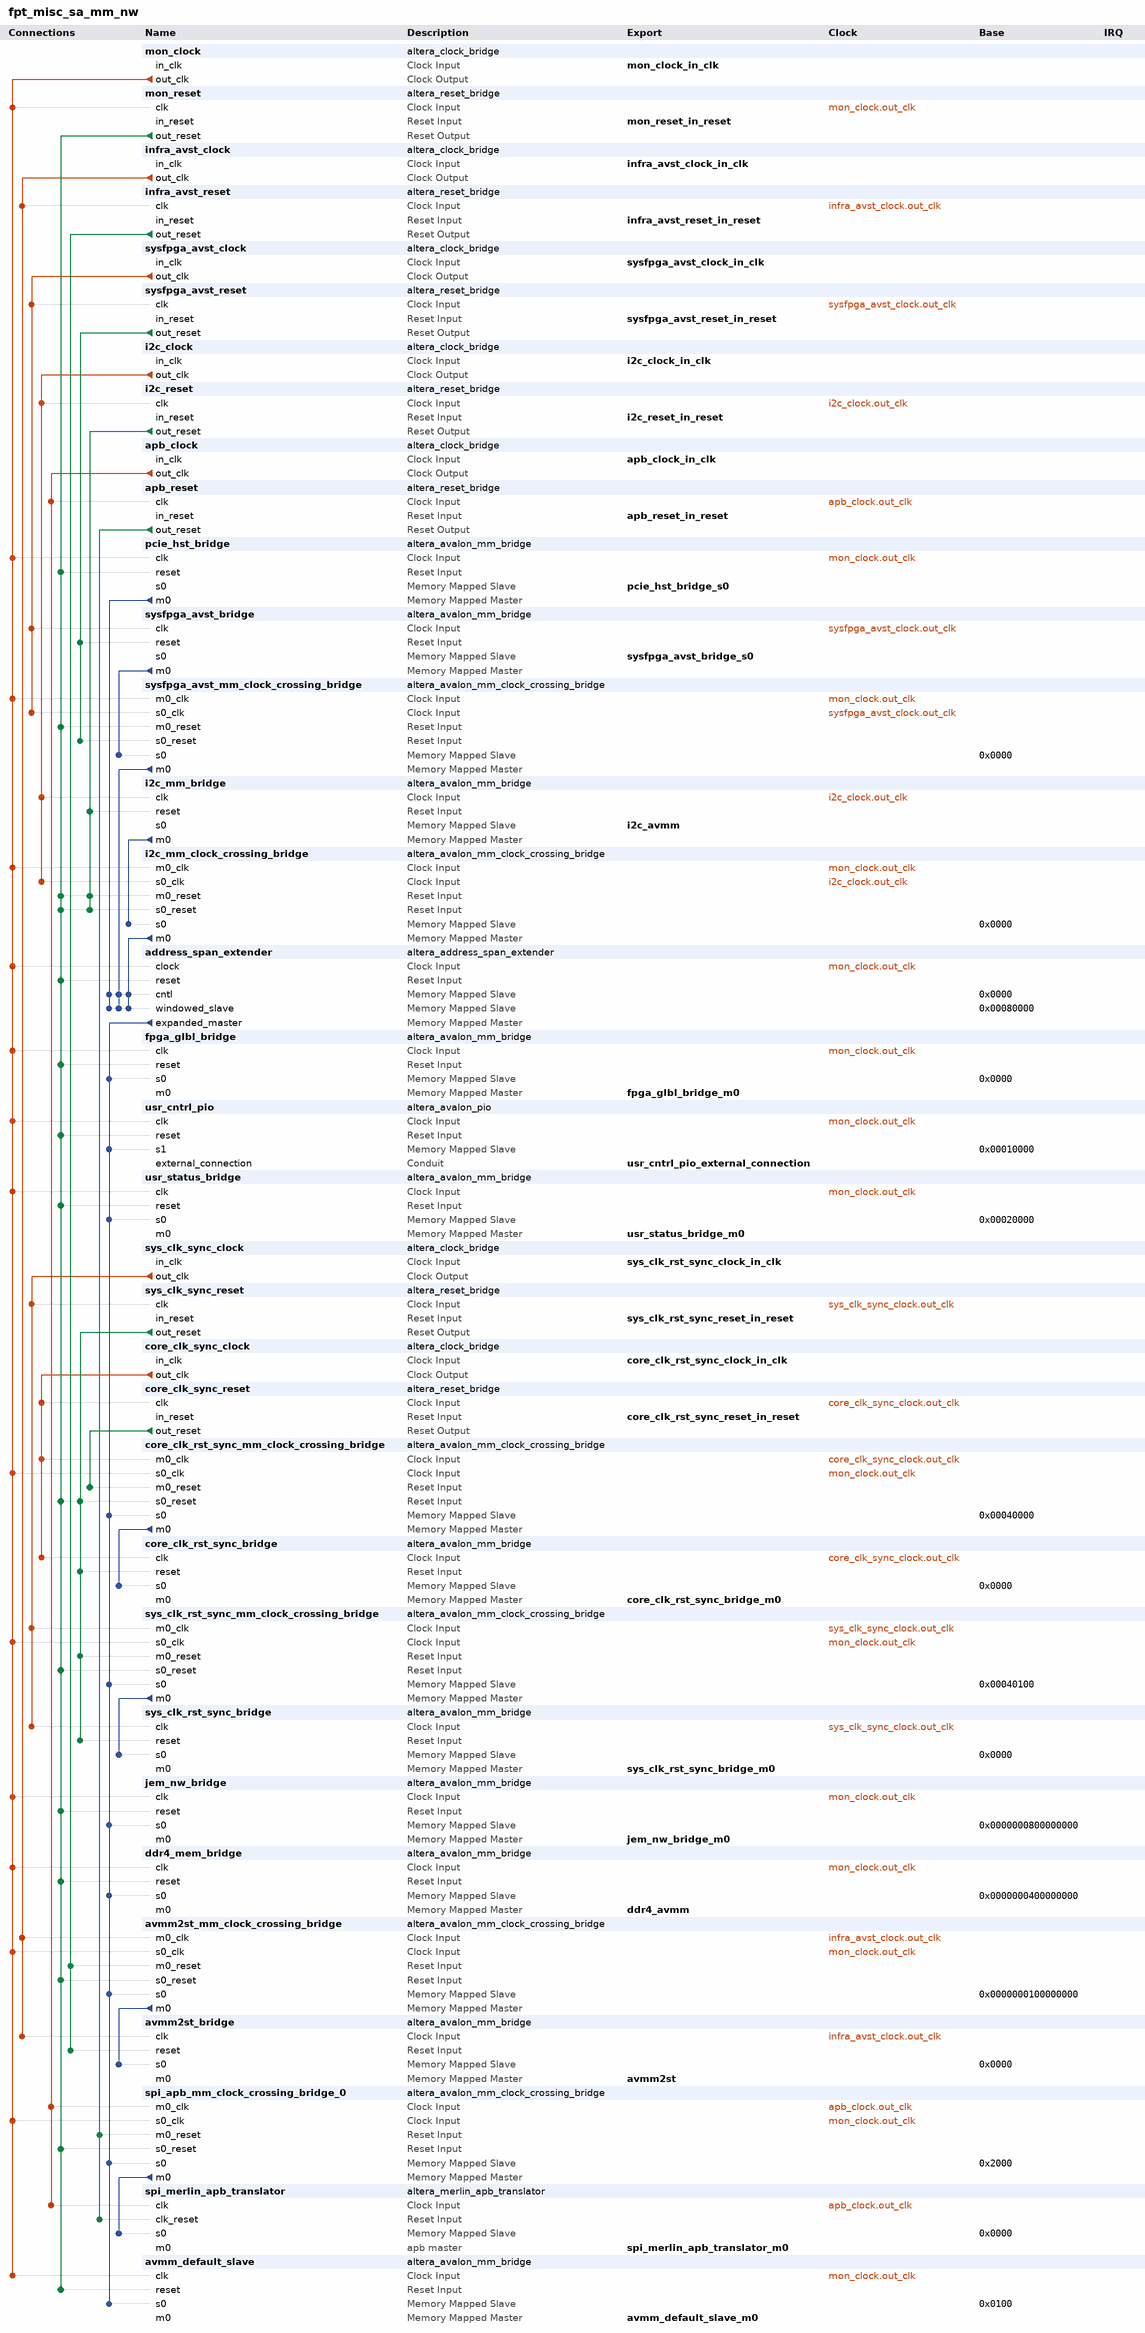
[diagram p0: system contents]
# Platform Designer (Qsys) system fpt_misc_sa_mm_nw, Stratix 10 1SG280LU3F50E1VG
# Parameters at their usual value, and those the tool derives, are not listed.
package require -exact qsys 1.0
create_system fpt_misc_sa_mm_nw
set_project_property DEVICE_FAMILY {Stratix 10}
set_project_property DEVICE 1SG280LU3F50E1VG

add_component mon_clock ip/fpt_misc_sa_mm_nw/fpt_misc_sa_mm_nw_clock_in.ip altera_clock_bridge mon_clock 19.2.0
load_component mon_clock
set_component_parameter_value DERIVED_CLOCK_RATE 0
set_component_parameter_value EXPLICIT_CLOCK_RATE 0
save_component

add_component mon_reset ip/fpt_misc_sa_mm_nw/fpt_misc_sa_mm_nw_reset_in.ip altera_reset_bridge mon_reset 19.2.0
load_component mon_reset
set_component_parameter_value ACTIVE_LOW_RESET 1
set_component_parameter_value SYNCHRONOUS_EDGES deassert
set_component_parameter_value SYNC_RESET 0
save_component

add_component infra_avst_clock ip/fpt_misc_sa_mm_nw/mon_clock_0.ip altera_clock_bridge infra_avst_clock 19.2.0
load_component infra_avst_clock
set_component_parameter_value DERIVED_CLOCK_RATE 0
set_component_parameter_value EXPLICIT_CLOCK_RATE 0
save_component

add_component infra_avst_reset ip/fpt_misc_sa_mm_nw/mon_reset_0.ip altera_reset_bridge infra_avst_reset 19.2.0
load_component infra_avst_reset
set_component_parameter_value ACTIVE_LOW_RESET 1
set_component_parameter_value SYNCHRONOUS_EDGES deassert
set_component_parameter_value SYNC_RESET 0
save_component

add_component sysfpga_avst_clock ip/fpt_misc_sa_mm_nw/infra_avst_clock_0.ip altera_clock_bridge sysfpga_avst_clock 19.2.0
load_component sysfpga_avst_clock
set_component_parameter_value DERIVED_CLOCK_RATE 0
set_component_parameter_value EXPLICIT_CLOCK_RATE 0
save_component

add_component sysfpga_avst_reset ip/fpt_misc_sa_mm_nw/infra_avst_reset_0.ip altera_reset_bridge sysfpga_avst_reset 19.2.0
load_component sysfpga_avst_reset
set_component_parameter_value ACTIVE_LOW_RESET 1
set_component_parameter_value SYNCHRONOUS_EDGES deassert
set_component_parameter_value SYNC_RESET 0
save_component

add_component i2c_clock ip/fpt_misc_sa_mm_nw/fpt_misc_sa_mm_nw_clock_bridge_1.ip altera_clock_bridge i2c_clock 19.2.0
load_component i2c_clock
set_component_parameter_value DERIVED_CLOCK_RATE 0
set_component_parameter_value EXPLICIT_CLOCK_RATE 0
save_component

add_component i2c_reset ip/fpt_misc_sa_mm_nw/fpt_misc_sa_mm_nw_reset_bridge_1.ip altera_reset_bridge i2c_reset 19.2.0
load_component i2c_reset
set_component_parameter_value ACTIVE_LOW_RESET 1
set_component_parameter_value SYNCHRONOUS_EDGES deassert
set_component_parameter_value SYNC_RESET 0
save_component

add_component apb_clock ip/fpt_misc_sa_mm_nw/i2c_clock_0.ip altera_clock_bridge apb_clock 19.2.0
load_component apb_clock
set_component_parameter_value DERIVED_CLOCK_RATE 0
set_component_parameter_value EXPLICIT_CLOCK_RATE 0
save_component

add_component apb_reset ip/fpt_misc_sa_mm_nw/i2c_reset_0.ip altera_reset_bridge apb_reset 19.2.0
load_component apb_reset
set_component_parameter_value ACTIVE_LOW_RESET 1
set_component_parameter_value SYNCHRONOUS_EDGES deassert
set_component_parameter_value SYNC_RESET 0
save_component

add_component pcie_hst_bridge ip/fpt_misc_sa_mm_nw/fpt_misc_sa_mm_nw_mm_bridge_0.ip altera_avalon_mm_bridge pcie_hst_bridge 20.0.0
load_component pcie_hst_bridge
set_component_parameter_value DATA_WIDTH 32
set_component_parameter_value ADDRESS_WIDTH 20
set_component_parameter_value USE_AUTO_ADDRESS_WIDTH 0
set_component_parameter_value ADDRESS_UNITS SYMBOLS
set_component_parameter_value MAX_PENDING_RESPONSES 4
set_component_parameter_value MAX_PENDING_WRITES 0
set_component_parameter_value SYNC_RESET 0
set_component_parameter_value USE_WRITERESPONSE 0
save_component

add_component sysfpga_avst_bridge ip/fpt_misc_sa_mm_nw/pcie_hst_bridge_0.ip altera_avalon_mm_bridge sysfpga_avst_bridge 20.0.0
load_component sysfpga_avst_bridge
set_component_parameter_value DATA_WIDTH 32
set_component_parameter_value ADDRESS_WIDTH 24
set_component_parameter_value USE_AUTO_ADDRESS_WIDTH 0
set_component_parameter_value ADDRESS_UNITS SYMBOLS
set_component_parameter_value MAX_PENDING_RESPONSES 4
set_component_parameter_value MAX_PENDING_WRITES 0
set_component_parameter_value SYNC_RESET 0
set_component_parameter_value USE_WRITERESPONSE 0
save_component

add_component sysfpga_avst_mm_clock_crossing_bridge ip/fpt_misc_sa_mm_nw/fpt_misc_sa_mm_nw_mm_clock_crossing_bridge_1.ip altera_avalon_mm_clock_crossing_bridge sysfpga_avst_mm_clock_crossing_bridge 19.2.0
load_component sysfpga_avst_mm_clock_crossing_bridge
set_component_parameter_value DATA_WIDTH 32
set_component_parameter_value ADDRESS_WIDTH 24
set_component_parameter_value USE_AUTO_ADDRESS_WIDTH 0
set_component_parameter_value MAX_BURST_SIZE 1
set_component_parameter_value COMMAND_FIFO_DEPTH 4
set_component_parameter_value RESPONSE_FIFO_DEPTH 4
set_component_parameter_value MASTER_SYNC_DEPTH 2
set_component_parameter_value SLAVE_SYNC_DEPTH 2
set_component_parameter_value SYNC_RESET 0
save_component

add_component i2c_mm_bridge ip/fpt_misc_sa_mm_nw/fpt_misc_sa_mm_nw_mm_bridge_3.ip altera_avalon_mm_bridge i2c_mm_bridge 20.0.0
load_component i2c_mm_bridge
set_component_parameter_value DATA_WIDTH 32
set_component_parameter_value ADDRESS_WIDTH 20
set_component_parameter_value USE_AUTO_ADDRESS_WIDTH 0
set_component_parameter_value ADDRESS_UNITS SYMBOLS
set_component_parameter_value MAX_PENDING_RESPONSES 4
set_component_parameter_value MAX_PENDING_WRITES 0
set_component_parameter_value SYNC_RESET 0
set_component_parameter_value USE_WRITERESPONSE 0
save_component

add_component i2c_mm_clock_crossing_bridge ip/fpt_misc_sa_mm_nw/fpt_misc_sa_mm_nw_mm_clock_crossing_bridge_3.ip altera_avalon_mm_clock_crossing_bridge i2c_mm_clock_crossing_bridge 19.2.0
load_component i2c_mm_clock_crossing_bridge
set_component_parameter_value DATA_WIDTH 32
set_component_parameter_value ADDRESS_WIDTH 20
set_component_parameter_value USE_AUTO_ADDRESS_WIDTH 0
set_component_parameter_value MAX_BURST_SIZE 1
set_component_parameter_value COMMAND_FIFO_DEPTH 4
set_component_parameter_value RESPONSE_FIFO_DEPTH 4
set_component_parameter_value MASTER_SYNC_DEPTH 2
set_component_parameter_value SLAVE_SYNC_DEPTH 2
set_component_parameter_value SYNC_RESET 0
save_component

add_component address_span_extender ip/fpt_misc_sa_mm_nw/fpt_misc_sa_mm_nw_address_span_extender_0.ip altera_address_span_extender address_span_extender 19.2.0
load_component address_span_extender
set_component_parameter_value DATA_WIDTH 32
set_component_parameter_value MASTER_ADDRESS_WIDTH 36
set_component_parameter_value SLAVE_ADDRESS_WIDTH 16
set_component_parameter_value BURSTCOUNT_WIDTH 11
set_component_parameter_value SUB_WINDOW_COUNT 4
set_component_parameter_value MASTER_ADDRESS_DEF 0
set_component_parameter_value ENABLE_SLAVE_PORT true
set_component_parameter_value MAX_PENDING_READS 4
set_component_parameter_value SYNC_RESET 0
save_component

add_component fpga_glbl_bridge ip/fpt_misc_sa_mm_nw/fpt_misc_sa_mm_nw_mm_bridge_1.ip altera_avalon_mm_bridge fpga_glbl_bridge 20.0.0
load_component fpga_glbl_bridge
set_component_parameter_value DATA_WIDTH 32
set_component_parameter_value ADDRESS_WIDTH 8
set_component_parameter_value USE_AUTO_ADDRESS_WIDTH 0
set_component_parameter_value ADDRESS_UNITS SYMBOLS
set_component_parameter_value MAX_PENDING_RESPONSES 4
set_component_parameter_value MAX_PENDING_WRITES 0
set_component_parameter_value SYNC_RESET 0
set_component_parameter_value USE_WRITERESPONSE 0
save_component

add_component usr_cntrl_pio ip/fpt_misc_sa_mm_nw/fpt_misc_sa_mm_nw_pio_0.ip altera_avalon_pio usr_cntrl_pio 19.1.0
load_component usr_cntrl_pio
set_component_parameter_value bitModifyingOutReg true
set_component_parameter_value direction Output
set_component_parameter_value width 32
save_component

add_component usr_status_bridge ip/fpt_misc_sa_mm_nw/fpga_glbl_bridge_0.ip altera_avalon_mm_bridge usr_status_bridge 20.0.0
load_component usr_status_bridge
set_component_parameter_value DATA_WIDTH 32
set_component_parameter_value ADDRESS_WIDTH 8
set_component_parameter_value USE_AUTO_ADDRESS_WIDTH 0
set_component_parameter_value ADDRESS_UNITS SYMBOLS
set_component_parameter_value MAX_PENDING_RESPONSES 4
set_component_parameter_value MAX_PENDING_WRITES 0
set_component_parameter_value SYNC_RESET 0
set_component_parameter_value USE_WRITERESPONSE 0
save_component

add_component sys_clk_sync_clock ip/fpt_misc_sa_mm_nw/fpt_misc_sa_mm_nw_clock_bridge_0.ip altera_clock_bridge sys_clk_sync_clock 19.2.0
load_component sys_clk_sync_clock
set_component_parameter_value DERIVED_CLOCK_RATE 0
set_component_parameter_value EXPLICIT_CLOCK_RATE 0
save_component

add_component sys_clk_sync_reset ip/fpt_misc_sa_mm_nw/fpt_misc_sa_mm_nw_reset_bridge_0.ip altera_reset_bridge sys_clk_sync_reset 19.2.0
load_component sys_clk_sync_reset
set_component_parameter_value ACTIVE_LOW_RESET 1
set_component_parameter_value SYNCHRONOUS_EDGES deassert
set_component_parameter_value SYNC_RESET 0
save_component

add_component core_clk_sync_clock ip/fpt_misc_sa_mm_nw/sys_clk_sync_clock_0.ip altera_clock_bridge core_clk_sync_clock 19.2.0
load_component core_clk_sync_clock
set_component_parameter_value DERIVED_CLOCK_RATE 0
set_component_parameter_value EXPLICIT_CLOCK_RATE 0
save_component

add_component core_clk_sync_reset ip/fpt_misc_sa_mm_nw/sys_clk_sync_reset_0.ip altera_reset_bridge core_clk_sync_reset 19.2.0
load_component core_clk_sync_reset
set_component_parameter_value ACTIVE_LOW_RESET 1
set_component_parameter_value SYNCHRONOUS_EDGES deassert
set_component_parameter_value SYNC_RESET 0
save_component

add_component core_clk_rst_sync_mm_clock_crossing_bridge ip/fpt_misc_sa_mm_nw/fpt_misc_sa_mm_nw_mm_clock_crossing_bridge_2.ip altera_avalon_mm_clock_crossing_bridge core_clk_rst_sync_mm_clock_crossing_bridge 19.2.0
load_component core_clk_rst_sync_mm_clock_crossing_bridge
set_component_parameter_value DATA_WIDTH 32
set_component_parameter_value ADDRESS_WIDTH 8
set_component_parameter_value USE_AUTO_ADDRESS_WIDTH 0
set_component_parameter_value MAX_BURST_SIZE 1
set_component_parameter_value COMMAND_FIFO_DEPTH 4
set_component_parameter_value RESPONSE_FIFO_DEPTH 4
set_component_parameter_value MASTER_SYNC_DEPTH 2
set_component_parameter_value SLAVE_SYNC_DEPTH 2
set_component_parameter_value SYNC_RESET 0
save_component

add_component core_clk_rst_sync_bridge ip/fpt_misc_sa_mm_nw/usr_status_bridge_0.ip altera_avalon_mm_bridge core_clk_rst_sync_bridge 20.0.0
load_component core_clk_rst_sync_bridge
set_component_parameter_value DATA_WIDTH 32
set_component_parameter_value ADDRESS_WIDTH 8
set_component_parameter_value USE_AUTO_ADDRESS_WIDTH 0
set_component_parameter_value ADDRESS_UNITS SYMBOLS
set_component_parameter_value MAX_PENDING_RESPONSES 4
set_component_parameter_value MAX_PENDING_WRITES 0
set_component_parameter_value SYNC_RESET 0
set_component_parameter_value USE_WRITERESPONSE 0
save_component

add_component sys_clk_rst_sync_mm_clock_crossing_bridge ip/fpt_misc_sa_mm_nw/fpt_misc_sa_mm_nw_mm_clock_crossing_bridge_2.ip altera_avalon_mm_clock_crossing_bridge sys_clk_rst_sync_mm_clock_crossing_bridge 19.2.0
load_component sys_clk_rst_sync_mm_clock_crossing_bridge
set_component_parameter_value DATA_WIDTH 32
set_component_parameter_value ADDRESS_WIDTH 8
set_component_parameter_value USE_AUTO_ADDRESS_WIDTH 0
set_component_parameter_value MAX_BURST_SIZE 1
set_component_parameter_value COMMAND_FIFO_DEPTH 4
set_component_parameter_value RESPONSE_FIFO_DEPTH 4
set_component_parameter_value MASTER_SYNC_DEPTH 2
set_component_parameter_value SLAVE_SYNC_DEPTH 2
set_component_parameter_value SYNC_RESET 0
save_component

add_component sys_clk_rst_sync_bridge ip/fpt_misc_sa_mm_nw/usr_status_bridge_0.ip altera_avalon_mm_bridge sys_clk_rst_sync_bridge 20.0.0
load_component sys_clk_rst_sync_bridge
set_component_parameter_value DATA_WIDTH 32
set_component_parameter_value ADDRESS_WIDTH 8
set_component_parameter_value USE_AUTO_ADDRESS_WIDTH 0
set_component_parameter_value ADDRESS_UNITS SYMBOLS
set_component_parameter_value MAX_PENDING_RESPONSES 4
set_component_parameter_value MAX_PENDING_WRITES 0
set_component_parameter_value SYNC_RESET 0
set_component_parameter_value USE_WRITERESPONSE 0
save_component

add_component jem_nw_bridge ip/fpt_misc_sa_mm_nw/fpt_misc_sa_mm_nw_mm_bridge_2.ip altera_avalon_mm_bridge jem_nw_bridge 20.0.0
load_component jem_nw_bridge
set_component_parameter_value DATA_WIDTH 32
set_component_parameter_value ADDRESS_WIDTH 34
set_component_parameter_value USE_AUTO_ADDRESS_WIDTH 0
set_component_parameter_value ADDRESS_UNITS SYMBOLS
set_component_parameter_value MAX_BURST_SIZE 1024
set_component_parameter_value MAX_PENDING_RESPONSES 4
set_component_parameter_value MAX_PENDING_WRITES 0
set_component_parameter_value SYNC_RESET 0
set_component_parameter_value USE_WRITERESPONSE 0
save_component

add_component ddr4_mem_bridge ip/fpt_misc_sa_mm_nw/mm_bridge_0.ip altera_avalon_mm_bridge ddr4_mem_bridge 20.0.0
load_component ddr4_mem_bridge
set_component_parameter_value DATA_WIDTH 256
set_component_parameter_value ADDRESS_WIDTH 34
set_component_parameter_value USE_AUTO_ADDRESS_WIDTH 0
set_component_parameter_value ADDRESS_UNITS SYMBOLS
set_component_parameter_value MAX_BURST_SIZE 8
set_component_parameter_value MAX_PENDING_RESPONSES 4
set_component_parameter_value MAX_PENDING_WRITES 0
set_component_parameter_value SYNC_RESET 0
set_component_parameter_value USE_WRITERESPONSE 0
save_component

add_component avmm2st_mm_clock_crossing_bridge ip/fpt_misc_sa_mm_nw/fpt_misc_sa_mm_nw_mm_clock_crossing_bridge_0.ip altera_avalon_mm_clock_crossing_bridge avmm2st_mm_clock_crossing_bridge 19.2.0
load_component avmm2st_mm_clock_crossing_bridge
set_component_parameter_value DATA_WIDTH 32
set_component_parameter_value ADDRESS_WIDTH 32
set_component_parameter_value USE_AUTO_ADDRESS_WIDTH 0
set_component_parameter_value MAX_BURST_SIZE 1
set_component_parameter_value COMMAND_FIFO_DEPTH 4
set_component_parameter_value RESPONSE_FIFO_DEPTH 4
set_component_parameter_value MASTER_SYNC_DEPTH 2
set_component_parameter_value SLAVE_SYNC_DEPTH 2
set_component_parameter_value SYNC_RESET 0
save_component

add_component avmm2st_bridge ip/fpt_misc_sa_mm_nw/fpt_misc_sa_mm_nw_mm_bridge_4.ip altera_avalon_mm_bridge avmm2st_bridge 20.0.0
load_component avmm2st_bridge
set_component_parameter_value DATA_WIDTH 32
set_component_parameter_value ADDRESS_WIDTH 32
set_component_parameter_value USE_AUTO_ADDRESS_WIDTH 0
set_component_parameter_value ADDRESS_UNITS SYMBOLS
set_component_parameter_value MAX_PENDING_RESPONSES 4
set_component_parameter_value MAX_PENDING_WRITES 0
set_component_parameter_value SYNC_RESET 0
set_component_parameter_value USE_WRITERESPONSE 0
save_component

add_component spi_apb_mm_clock_crossing_bridge_0 ip/fpt_misc_sa_mm_nw/fpt_misc_sa_mm_nw_mm_clock_crossing_bridge_4.ip altera_avalon_mm_clock_crossing_bridge spi_apb_mm_clock_crossing_bridge_0 19.2.0
load_component spi_apb_mm_clock_crossing_bridge_0
set_component_parameter_value DATA_WIDTH 32
set_component_parameter_value ADDRESS_WIDTH 13
set_component_parameter_value USE_AUTO_ADDRESS_WIDTH 0
set_component_parameter_value MAX_BURST_SIZE 1
set_component_parameter_value COMMAND_FIFO_DEPTH 4
set_component_parameter_value RESPONSE_FIFO_DEPTH 4
set_component_parameter_value MASTER_SYNC_DEPTH 2
set_component_parameter_value SLAVE_SYNC_DEPTH 2
set_component_parameter_value SYNC_RESET 0
save_component

add_component spi_merlin_apb_translator ip/fpt_misc_sa_mm_nw/fpt_misc_sa_mm_nw_merlin_apb_translator_0.ip altera_merlin_apb_translator spi_merlin_apb_translator 19.2.0
load_component spi_merlin_apb_translator
set_component_parameter_value ADDR_WIDTH 13
set_component_parameter_value DATA_WIDTH 32
set_component_parameter_value USE_S0_PADDR31 false
set_component_parameter_value USE_M0_PADDR31 false
set_component_parameter_value USE_M0_PSLVERR false
set_component_parameter_value SYNC_RESET 0
save_component

add_component avmm_default_slave ip/fpt_misc_sa_mm_nw/fpt_misc_sa_mm_nw_mm_bridge_5.ip altera_avalon_mm_bridge avmm_default_slave 20.0.0
load_component avmm_default_slave
set_component_parameter_value DATA_WIDTH 32
set_component_parameter_value ADDRESS_WIDTH 3
set_component_parameter_value USE_AUTO_ADDRESS_WIDTH 0
set_component_parameter_value ADDRESS_UNITS SYMBOLS
set_component_parameter_value MAX_PENDING_RESPONSES 4
set_component_parameter_value MAX_PENDING_WRITES 0
set_component_parameter_value SYNC_RESET 0
set_component_parameter_value USE_WRITERESPONSE 0
save_component

# connections
add_connection apb_clock.out_clk apb_reset.clk clock
add_connection apb_clock.out_clk spi_apb_mm_clock_crossing_bridge_0.m0_clk clock
add_connection apb_clock.out_clk spi_merlin_apb_translator.clk clock
add_connection core_clk_sync_clock.out_clk core_clk_rst_sync_bridge.clk clock
add_connection core_clk_sync_clock.out_clk core_clk_rst_sync_mm_clock_crossing_bridge.m0_clk clock
add_connection core_clk_sync_clock.out_clk core_clk_sync_reset.clk clock
add_connection i2c_clock.out_clk i2c_mm_bridge.clk clock
add_connection i2c_clock.out_clk i2c_mm_clock_crossing_bridge.s0_clk clock
add_connection i2c_clock.out_clk i2c_reset.clk clock
add_connection infra_avst_clock.out_clk avmm2st_bridge.clk clock
add_connection infra_avst_clock.out_clk avmm2st_mm_clock_crossing_bridge.m0_clk clock
add_connection infra_avst_clock.out_clk infra_avst_reset.clk clock
add_connection mon_clock.out_clk address_span_extender.clock clock
add_connection mon_clock.out_clk avmm2st_mm_clock_crossing_bridge.s0_clk clock
add_connection mon_clock.out_clk avmm_default_slave.clk clock
add_connection mon_clock.out_clk core_clk_rst_sync_mm_clock_crossing_bridge.s0_clk clock
add_connection mon_clock.out_clk ddr4_mem_bridge.clk clock
add_connection mon_clock.out_clk fpga_glbl_bridge.clk clock
add_connection mon_clock.out_clk i2c_mm_clock_crossing_bridge.m0_clk clock
add_connection mon_clock.out_clk jem_nw_bridge.clk clock
add_connection mon_clock.out_clk mon_reset.clk clock
add_connection mon_clock.out_clk pcie_hst_bridge.clk clock
add_connection mon_clock.out_clk spi_apb_mm_clock_crossing_bridge_0.s0_clk clock
add_connection mon_clock.out_clk sys_clk_rst_sync_mm_clock_crossing_bridge.s0_clk clock
add_connection mon_clock.out_clk sysfpga_avst_mm_clock_crossing_bridge.m0_clk clock
add_connection mon_clock.out_clk usr_cntrl_pio.clk clock
add_connection mon_clock.out_clk usr_status_bridge.clk clock
add_connection sys_clk_sync_clock.out_clk sys_clk_rst_sync_bridge.clk clock
add_connection sys_clk_sync_clock.out_clk sys_clk_rst_sync_mm_clock_crossing_bridge.m0_clk clock
add_connection sys_clk_sync_clock.out_clk sys_clk_sync_reset.clk clock
add_connection sysfpga_avst_clock.out_clk sysfpga_avst_bridge.clk clock
add_connection sysfpga_avst_clock.out_clk sysfpga_avst_mm_clock_crossing_bridge.s0_clk clock
add_connection sysfpga_avst_clock.out_clk sysfpga_avst_reset.clk clock
add_connection apb_reset.out_reset spi_apb_mm_clock_crossing_bridge_0.m0_reset reset
add_connection apb_reset.out_reset spi_merlin_apb_translator.clk_reset reset
add_connection core_clk_sync_reset.out_reset core_clk_rst_sync_mm_clock_crossing_bridge.m0_reset reset
add_connection i2c_reset.out_reset i2c_mm_bridge.reset reset
add_connection i2c_reset.out_reset i2c_mm_clock_crossing_bridge.m0_reset reset
add_connection i2c_reset.out_reset i2c_mm_clock_crossing_bridge.s0_reset reset
add_connection infra_avst_reset.out_reset avmm2st_bridge.reset reset
add_connection infra_avst_reset.out_reset avmm2st_mm_clock_crossing_bridge.m0_reset reset
add_connection mon_reset.out_reset address_span_extender.reset reset
add_connection mon_reset.out_reset avmm2st_mm_clock_crossing_bridge.s0_reset reset
add_connection mon_reset.out_reset avmm_default_slave.reset reset
add_connection mon_reset.out_reset core_clk_rst_sync_mm_clock_crossing_bridge.s0_reset reset
add_connection mon_reset.out_reset ddr4_mem_bridge.reset reset
add_connection mon_reset.out_reset fpga_glbl_bridge.reset reset
add_connection mon_reset.out_reset i2c_mm_clock_crossing_bridge.m0_reset reset
add_connection mon_reset.out_reset i2c_mm_clock_crossing_bridge.s0_reset reset
add_connection mon_reset.out_reset jem_nw_bridge.reset reset
add_connection mon_reset.out_reset pcie_hst_bridge.reset reset
add_connection mon_reset.out_reset spi_apb_mm_clock_crossing_bridge_0.s0_reset reset
add_connection mon_reset.out_reset sys_clk_rst_sync_mm_clock_crossing_bridge.s0_reset reset
add_connection mon_reset.out_reset sysfpga_avst_mm_clock_crossing_bridge.m0_reset reset
add_connection mon_reset.out_reset usr_cntrl_pio.reset reset
add_connection mon_reset.out_reset usr_status_bridge.reset reset
add_connection sys_clk_sync_reset.out_reset core_clk_rst_sync_bridge.reset reset
add_connection sys_clk_sync_reset.out_reset core_clk_rst_sync_mm_clock_crossing_bridge.s0_reset reset
add_connection sys_clk_sync_reset.out_reset sys_clk_rst_sync_bridge.reset reset
add_connection sys_clk_sync_reset.out_reset sys_clk_rst_sync_mm_clock_crossing_bridge.m0_reset reset
add_connection sysfpga_avst_reset.out_reset sysfpga_avst_bridge.reset reset
add_connection sysfpga_avst_reset.out_reset sysfpga_avst_mm_clock_crossing_bridge.s0_reset reset
add_connection address_span_extender.expanded_master avmm2st_mm_clock_crossing_bridge.s0 avalon
set_connection_parameter_value address_span_extender.expanded_master/avmm2st_mm_clock_crossing_bridge.s0 baseAddress 0x0000000100000000
add_connection address_span_extender.expanded_master avmm_default_slave.s0 avalon
set_connection_parameter_value address_span_extender.expanded_master/avmm_default_slave.s0 baseAddress 0x0100
set_connection_parameter_value address_span_extender.expanded_master/avmm_default_slave.s0 defaultConnection true
add_connection address_span_extender.expanded_master core_clk_rst_sync_mm_clock_crossing_bridge.s0 avalon
set_connection_parameter_value address_span_extender.expanded_master/core_clk_rst_sync_mm_clock_crossing_bridge.s0 baseAddress 0x00040000
add_connection address_span_extender.expanded_master ddr4_mem_bridge.s0 avalon
set_connection_parameter_value address_span_extender.expanded_master/ddr4_mem_bridge.s0 baseAddress 0x0000000400000000
add_connection address_span_extender.expanded_master fpga_glbl_bridge.s0 avalon
set_connection_parameter_value address_span_extender.expanded_master/fpga_glbl_bridge.s0 baseAddress 0x0000
add_connection address_span_extender.expanded_master jem_nw_bridge.s0 avalon
set_connection_parameter_value address_span_extender.expanded_master/jem_nw_bridge.s0 baseAddress 0x0000000800000000
add_connection address_span_extender.expanded_master spi_apb_mm_clock_crossing_bridge_0.s0 avalon
set_connection_parameter_value address_span_extender.expanded_master/spi_apb_mm_clock_crossing_bridge_0.s0 baseAddress 0x2000
add_connection address_span_extender.expanded_master sys_clk_rst_sync_mm_clock_crossing_bridge.s0 avalon
set_connection_parameter_value address_span_extender.expanded_master/sys_clk_rst_sync_mm_clock_crossing_bridge.s0 baseAddress 0x00040100
add_connection address_span_extender.expanded_master usr_cntrl_pio.s1 avalon
set_connection_parameter_value address_span_extender.expanded_master/usr_cntrl_pio.s1 baseAddress 0x00010000
add_connection address_span_extender.expanded_master usr_status_bridge.s0 avalon
set_connection_parameter_value address_span_extender.expanded_master/usr_status_bridge.s0 baseAddress 0x00020000
add_connection avmm2st_mm_clock_crossing_bridge.m0 avmm2st_bridge.s0 avalon
set_connection_parameter_value avmm2st_mm_clock_crossing_bridge.m0/avmm2st_bridge.s0 baseAddress 0x0000
add_connection core_clk_rst_sync_mm_clock_crossing_bridge.m0 core_clk_rst_sync_bridge.s0 avalon
set_connection_parameter_value core_clk_rst_sync_mm_clock_crossing_bridge.m0/core_clk_rst_sync_bridge.s0 baseAddress 0x0000
add_connection i2c_mm_bridge.m0 i2c_mm_clock_crossing_bridge.s0 avalon
set_connection_parameter_value i2c_mm_bridge.m0/i2c_mm_clock_crossing_bridge.s0 baseAddress 0x0000
add_connection i2c_mm_clock_crossing_bridge.m0 address_span_extender.cntl avalon
set_connection_parameter_value i2c_mm_clock_crossing_bridge.m0/address_span_extender.cntl baseAddress 0x0000
add_connection i2c_mm_clock_crossing_bridge.m0 address_span_extender.windowed_slave avalon
set_connection_parameter_value i2c_mm_clock_crossing_bridge.m0/address_span_extender.windowed_slave baseAddress 0x00080000
add_connection pcie_hst_bridge.m0 address_span_extender.cntl avalon
set_connection_parameter_value pcie_hst_bridge.m0/address_span_extender.cntl baseAddress 0x0000
add_connection pcie_hst_bridge.m0 address_span_extender.windowed_slave avalon
set_connection_parameter_value pcie_hst_bridge.m0/address_span_extender.windowed_slave baseAddress 0x00080000
add_connection spi_apb_mm_clock_crossing_bridge_0.m0 spi_merlin_apb_translator.s0 avalon
set_connection_parameter_value spi_apb_mm_clock_crossing_bridge_0.m0/spi_merlin_apb_translator.s0 baseAddress 0x0000
add_connection sys_clk_rst_sync_mm_clock_crossing_bridge.m0 sys_clk_rst_sync_bridge.s0 avalon
set_connection_parameter_value sys_clk_rst_sync_mm_clock_crossing_bridge.m0/sys_clk_rst_sync_bridge.s0 baseAddress 0x0000
add_connection sysfpga_avst_bridge.m0 sysfpga_avst_mm_clock_crossing_bridge.s0 avalon
set_connection_parameter_value sysfpga_avst_bridge.m0/sysfpga_avst_mm_clock_crossing_bridge.s0 baseAddress 0x0000
add_connection sysfpga_avst_mm_clock_crossing_bridge.m0 address_span_extender.cntl avalon
set_connection_parameter_value sysfpga_avst_mm_clock_crossing_bridge.m0/address_span_extender.cntl baseAddress 0x0000
add_connection sysfpga_avst_mm_clock_crossing_bridge.m0 address_span_extender.windowed_slave avalon
set_connection_parameter_value sysfpga_avst_mm_clock_crossing_bridge.m0/address_span_extender.windowed_slave baseAddress 0x00080000

# exported interfaces
add_interface apb_clock_in_clk clock sink
set_interface_property apb_clock_in_clk EXPORT_OF apb_clock.in_clk
add_interface apb_reset_in_reset reset sink
set_interface_property apb_reset_in_reset EXPORT_OF apb_reset.in_reset
add_interface avmm2st avalon master
set_interface_property avmm2st EXPORT_OF avmm2st_bridge.m0
add_interface avmm_default_slave_m0 avalon master
set_interface_property avmm_default_slave_m0 EXPORT_OF avmm_default_slave.m0
add_interface core_clk_rst_sync_bridge_m0 avalon master
set_interface_property core_clk_rst_sync_bridge_m0 EXPORT_OF core_clk_rst_sync_bridge.m0
add_interface core_clk_rst_sync_clock_in_clk clock sink
set_interface_property core_clk_rst_sync_clock_in_clk EXPORT_OF core_clk_sync_clock.in_clk
add_interface core_clk_rst_sync_reset_in_reset reset sink
set_interface_property core_clk_rst_sync_reset_in_reset EXPORT_OF core_clk_sync_reset.in_reset
add_interface ddr4_avmm avalon master
set_interface_property ddr4_avmm EXPORT_OF ddr4_mem_bridge.m0
add_interface fpga_glbl_bridge_m0 avalon master
set_interface_property fpga_glbl_bridge_m0 EXPORT_OF fpga_glbl_bridge.m0
add_interface i2c_avmm avalon slave
set_interface_property i2c_avmm EXPORT_OF i2c_mm_bridge.s0
add_interface i2c_clock_in_clk clock sink
set_interface_property i2c_clock_in_clk EXPORT_OF i2c_clock.in_clk
add_interface i2c_reset_in_reset reset sink
set_interface_property i2c_reset_in_reset EXPORT_OF i2c_reset.in_reset
add_interface infra_avst_clock_in_clk clock sink
set_interface_property infra_avst_clock_in_clk EXPORT_OF infra_avst_clock.in_clk
add_interface infra_avst_reset_in_reset reset sink
set_interface_property infra_avst_reset_in_reset EXPORT_OF infra_avst_reset.in_reset
add_interface jem_nw_bridge_m0 avalon master
set_interface_property jem_nw_bridge_m0 EXPORT_OF jem_nw_bridge.m0
add_interface mon_clock_in_clk clock sink
set_interface_property mon_clock_in_clk EXPORT_OF mon_clock.in_clk
add_interface mon_reset_in_reset reset sink
set_interface_property mon_reset_in_reset EXPORT_OF mon_reset.in_reset
add_interface pcie_hst_bridge_s0 avalon slave
set_interface_property pcie_hst_bridge_s0 EXPORT_OF pcie_hst_bridge.s0
add_interface spi_merlin_apb_translator_m0 apb master
set_interface_property spi_merlin_apb_translator_m0 EXPORT_OF spi_merlin_apb_translator.m0
add_interface sys_clk_rst_sync_bridge_m0 avalon master
set_interface_property sys_clk_rst_sync_bridge_m0 EXPORT_OF sys_clk_rst_sync_bridge.m0
add_interface sys_clk_rst_sync_clock_in_clk clock sink
set_interface_property sys_clk_rst_sync_clock_in_clk EXPORT_OF sys_clk_sync_clock.in_clk
add_interface sys_clk_rst_sync_reset_in_reset reset sink
set_interface_property sys_clk_rst_sync_reset_in_reset EXPORT_OF sys_clk_sync_reset.in_reset
add_interface sysfpga_avst_bridge_s0 avalon slave
set_interface_property sysfpga_avst_bridge_s0 EXPORT_OF sysfpga_avst_bridge.s0
add_interface sysfpga_avst_clock_in_clk clock sink
set_interface_property sysfpga_avst_clock_in_clk EXPORT_OF sysfpga_avst_clock.in_clk
add_interface sysfpga_avst_reset_in_reset reset sink
set_interface_property sysfpga_avst_reset_in_reset EXPORT_OF sysfpga_avst_reset.in_reset
add_interface usr_cntrl_pio_external_connection conduit end
set_interface_property usr_cntrl_pio_external_connection EXPORT_OF usr_cntrl_pio.external_connection
add_interface usr_status_bridge_m0 avalon master
set_interface_property usr_status_bridge_m0 EXPORT_OF usr_status_bridge.m0

save_system fpt_misc_sa_mm_nw.qsys
